# Altium schematic sheet HMC5883L.SchDoc
size A4
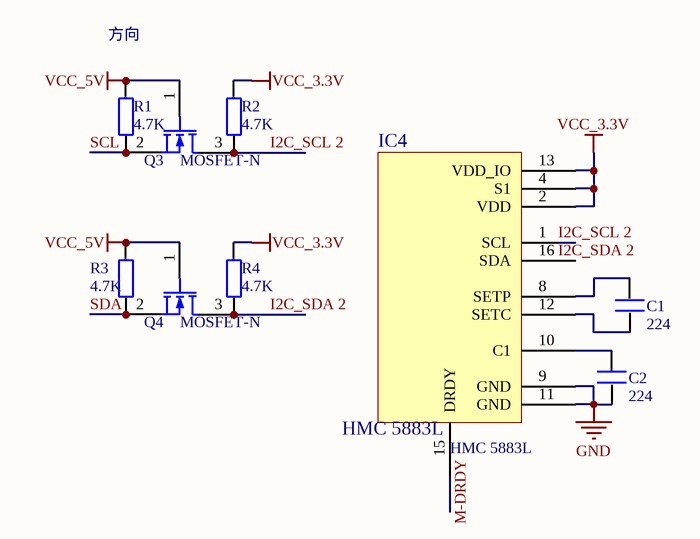
[diagram p0: HMC5883L.SchDoc]

## Parts
C1  224  [0805]
C2  224  [0805]
HMC_5883L  HMC 5883L  [PCBComponent_1]  (value not drawn)
Q3  MOSFET-N  [SOT-343_N]
Q4  MOSFET-N  [SOT-343_N]
R1  value 4.7K  [0805]  (hidden comment: Res2)
R2  value 4.7K  [0805]  (hidden comment: Res2)
R3  value 4.7K  [0805]  (hidden comment: Res2)
R4  value 4.7K  [0805]  (hidden comment: Res2)

## Nets
GND: C2.1 HMC_5883L.9(GND) HMC_5883L.11(GND)
VCC_3.3V: HMC_5883L.2(VDD) HMC_5883L.4(S1) HMC_5883L.13(VDD_IO) R2.2 R4.2
VCC_5V: Q3.1(G) Q4.1(G) R1.2 R3.2
I2C_SCL 2: HMC_5883L.1(SCL) Q3.3(D) R2.1
I2C_SDA 2: Q4.3(D) R4.1
SCL: Q3.2(S) R1.1
SDA: Q4.2(S) R3.1
NetC1_1: C1.1 HMC_5883L.12(SETC)
NetC1_2: C1.2 HMC_5883L.8(SETP)
NetC2_2: C2.2 HMC_5883L.10(C1)

Not connected (* = marked no-connect by the designer): HMC_5883L 15(DRDY) 16(SDA)

## Notes on the sheet
- 方向
- Labels drawn without touching a wire or pin: I2C_SDA 2, M-DRDY
- (in symbol HMC 5883L) IC4

## Library data of the parts
C1 C2 = C
Q3 Q4 = MOSFET-N1: MOSFET; Published: 8-Jun-2000; LatestRevisionDate: 17-Jul-2002; LatestRevisionNote: Re-released for DXP Platform.; PackageVersion: 1995/1996; PackageReference: E3; Publisher: Altium Limited
R1-R4 = Res2: Resistor; Published: 8-Jun-2000; LatestRevisionDate: 17-Jul-2002; LatestRevisionNote: Re-released for DXP Platform.; PackageReference: AXIAL-0.4; Publisher: Altium Limited; PackageDescription: Axial Device, Thru-Hole; 2 Leads; 0.4 in Pin Spacing